# EAGLE schematic 2naprazdno (EAGLE 9.5.2)
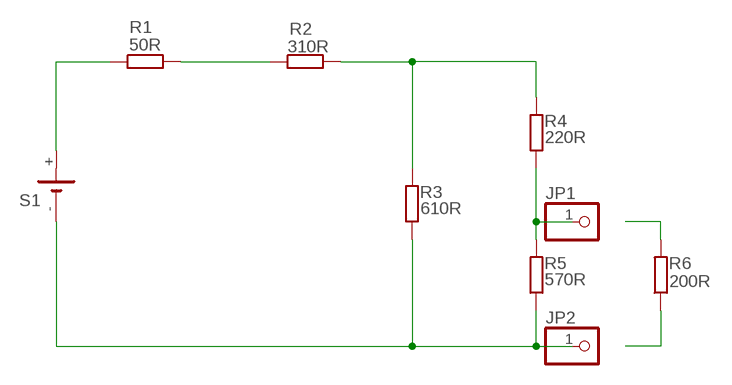
[diagram p0: schematic, sheet 1]

## Parts
JP1  PINHD-1X1  [1X01]
JP2  PINHD-1X1  [1X01]
R1  50R  R-EU_0204/7  [0204/7]
R2  310R  R-EU_0204/7  [0204/7]
R3  610R  R-EU_0204/7  [0204/7]
R4  220R  R-EU_0204/7  [0204/7]
R5  570R  R-EU_0204/7  [0204/7]
R6  200R  R-EU_0204/7  [0204/7]
S1  CH291-1220LF  [CH291-1220LF]

## Nets
N$1: R1.1 S1.+
N$2: R1.2 R2.1
N$3: R2.2 R3.2 R4.2
N$4: JP2.1 R3.1 R5.1 S1.-
N$5: JP1.1 R4.1 R5.2
N$6: R6.2
N$7: R6.1

## Library data of the parts
JP1 JP2 = pinhead:PINHD-1X1: PIN HEADER
R1-R6 = rcl:R-EU_: RESISTOR, European symbol; SPICEPREFIX: R
S1 = battery:CH291-1220LF: Battery Holder, SMT, 12mm multicomp PART NO. CH291-1220LF Source: Data sheet <http://www.farnell.com/datasheets/1505860.pdf>